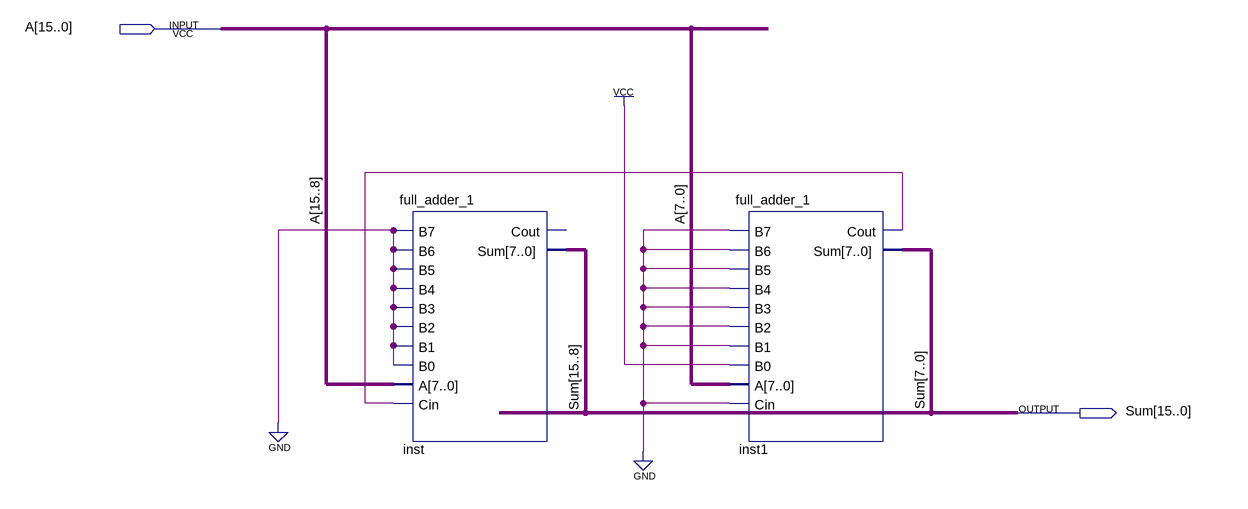
[diagram p0: schematic sheet]
// Quartus schematic full_adder_1_16bit.bdf as structural Verilog: 2 symbols, 2 pins
module full_adder_1_16bit (
  input  [15:0] A,
  output [15:0] Sum
);

  wire inst1_cout;

  full_adder_1 inst (
    .B7(1'b0), .B6(1'b0), .B5(1'b0), .B4(1'b0), .B3(1'b0), .B2(1'b0), .B1(1'b0), .B0(1'b0), .A(A[15:8]),
    .Cin(inst1_cout), .Sum(Sum[15:8]));  // open: Cout
  full_adder_1 inst1 (
    .B7(1'b0), .B6(1'b0), .B5(1'b0), .B4(1'b0), .B3(1'b0), .B2(1'b0), .B1(1'b0), .B0(1'b1), .A(A[7:0]),
    .Cin(1'b0), .Cout(inst1_cout), .Sum(Sum[7:0]));
endmodule
